# Altium project Printer.PrjPcb (part 2 of 2)

## Sheet 7.4v_BOOST.schdoc: Printer
size 431 x 279 mm; Date: 2022; Author: Renaissance; CompanyName: Upenn-ESE516; DrawnBy: Xinyang Tan;  Yuxin Wang; Engineer: Xinyang Tan;  Yuxin Wang; Address1: 200 S 33 St; Address2: Moore Building, Rm 101; Address3: Philadephla, PA 19104; DocumentNumber: 3; Revision: 1.0; SheetNumber: 3; SheetTotal: 9
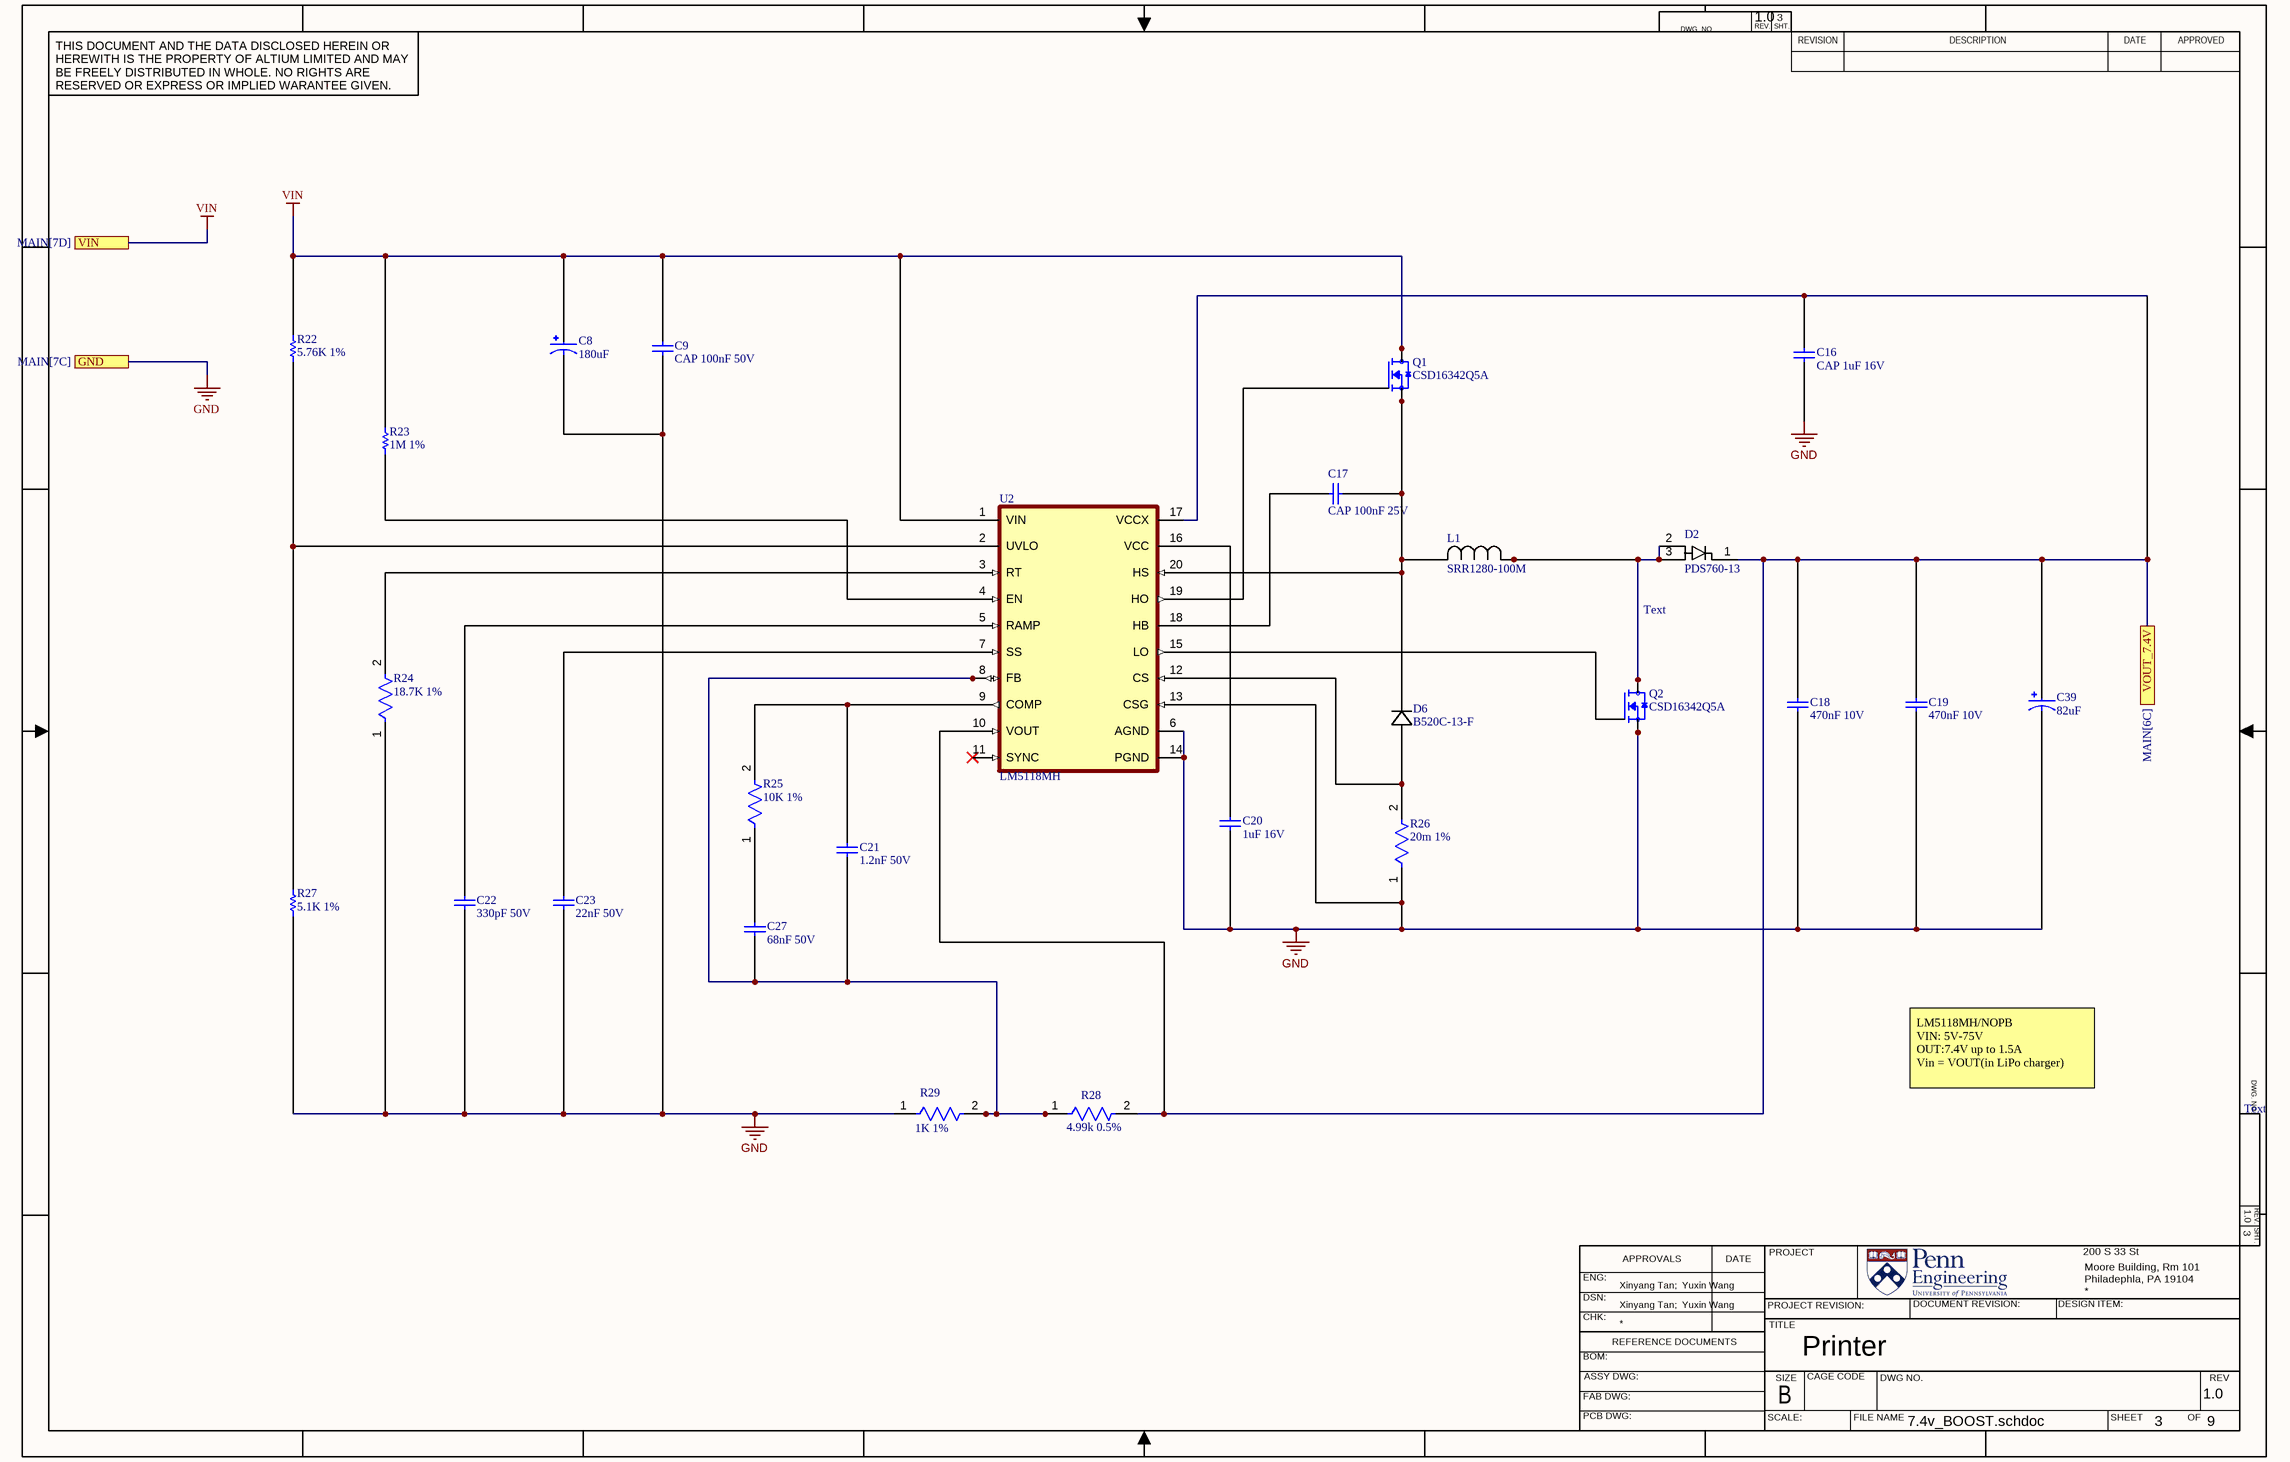
[diagram p7: 7.4v_BOOST.schdoc]

### Parts
C8  180uF  [CAP_16SVPF180M]
C9  CAP 100nF 50V  [CAPC0805(2012)100_L]
C16  CAP 1uF 16V  [CAPC0805(2012)100_N]
C17  CAP 100nF 25V  [CAPC0805(2012)75_M]
C18  470nF 10V  [CAPC0402(1005)60_M]
C19  470nF 10V  [CAPC0402(1005)60_M]
C20  1uF 16V  [CAPC0805(2012)100_N]
C21  1.2nF 50V  [CAPC0805(2012)100_L]
C22  330pF 50V  [CAPC0805(2012)145_L]
C23  22nF 50V  [CAPC0805(2012)75_N]
C27  68nF 50V  [CAPC1206(3216)100_L]
C39  82uF  [CHEMI-F80]
D2  PDS760-13  [POWERDI5_DIO]
D6  B520C-13-F  [SMC_DIO]
L1  SRR1280-100M  [IND_BOURNS_SRR1280]
Q1  CSD16342Q5A  [DQJ8_TEX]
Q2  CSD16342Q5A  [DQJ8_TEX]
R22  5.76K 1%  [RESC1608X55X25ML10T15]
R23  1M 1%  [RESC1608X55X25LL10T15]
R24  18.7K 1%  [FP-RT0805-MFG]
R25  10K 1%  [FP-RMCF0402-IPC_C]
R26  20m 1%  [FP-PRL1632-IPC_B]
R27  5.1K 1%  [RESC1608X55X25ML10T15]
R28  4.99k 0.5%  [FP-RG1608-IPC_C]
R29  1K 1%  [FP-RC0603-0_55-IPC_C]
U2  LM5118MH  [MXA20A]

### Ports
GND (see MAIN[7C]), VIN (see MAIN[7D]), VOUT_7.4V (see MAIN[6C])

### Nets
GND: C8.2 C9.1 C16.1 C18.1 C19.1 C20.1 C22.1 C23.1 C39.2 Q2.1(S) Q2.2(S) Q2.3(S) R24.1 R26.1 R27.1 R29.1 U2.6(AGND) U2.13(CSG) U2.14(PGND) ; port GND
VIN: C8.1 C9.2 Q1.5(D) Q1.6(D) Q1.7(D) Q1.8(D) R22.2 R23.2 U2.1(VIN) ; port VIN  [project net VOUT]
VOUT_7.4V: C16.2 C18.2 C19.2 C39.1 D2.1 R28.2 U2.10(VOUT) U2.17(VCCX) ; port VOUT_7.4V
NetC17_1: C17.1 U2.18(HB)
NetC17_2: C17.2 D6.1 L1.2 Q1.1(S) Q1.2(S) Q1.3(S) U2.20(HS)
NetC20_2: C20.2 U2.16(VCC)
NetC21_1: C21.1 C27.1 R28.1 R29.2 U2.8(FB)
NetC21_2: C21.2 R25.2 U2.9(COMP)
NetC22_2: C22.2 U2.5(RAMP)
NetC23_2: C23.2 U2.7(SS)
NetC27_2: C27.2 R25.1
NetD2_2: D2.2 D2.3 L1.1 Q2.5(D) Q2.6(D) Q2.7(D) Q2.8(D)
NetD6_2: D6.2 R26.2 U2.12(CS)
NetQ1_4: Q1.4(G) U2.19(HO)
NetQ2_4: Q2.4(G) U2.15(LO)
NetR22_1: R22.1 R27.2 U2.2(UVLO)
NetR23_1: R23.1 U2.4(EN)
NetR24_2: R24.2 U2.3(RT)

Not connected (* = marked no-connect by the designer): U2 11(SYNC)*

### Notes on the sheet
- Text
- LM5118MH/NOPB
  VIN: 5V-75V
  OUT:7.4V up to 1.5A
  Vin = VOUT(in LiPo charger)
- DWG. NO.
- REV.
- SHT.
- THIS DOCUMENT AND THE DATA DISCLOSED HEREIN OR HEREWITH IS THE PROPERTY OF ALTIUM LIMITED AND MAY BE FREELY DISTRIBUTED IN WHOLE. NO RIGHTS ARE RESERVED OR EXPRESS OR IMPLIED WARANTEE GIVEN.
- REVISION
- DESCRIPTION
- DATE
- APPROVED
- ENG:
- APPROVALS
- PROJECT
- DSN:
- CHK:
- REFERENCE DOCUMENTS
- PROJECT REVISION:
- TITLE
- DOCUMENT REVISION:
- DESIGN ITEM:
- BOM:
- FAB DWG:
- PCB DWG:
- ASSY DWG:
- SCALE:
- SIZE
- B
- CAGE CODE
- FILE NAME
- DWG NO.
- SHEET
- OF
- REV

### Library data of the parts
C8 = 16SVPF180M: Price: None; MP: 16SVPF180M; Availability: Unavailable; Value: *; Package: None
C9 = CMP-1036-04418-1: CAP 100nF 50V ±5% 0805 (2012 Metric) Thickness 1mm SMD; Case-EIA: 0805; Tolerance: Â±5%; Case-Metric: 2012; Max Thickness: 1 mm; Technology: SMT; Value: 100nF; Rated Voltage: 50 V
C16 C20 = CMP-1036-04745-1: CAP 1uF 16V ±5% 0805 (2012 Metric) Thickness 1mm SMD; Case-Metric: 2012; Case-EIA: 0805; Tolerance: Â±5%; Value: 1uF; Technology: SMT; Rated Voltage: 16 V; Max Thickness: 1 mm
C17 = CMP-1036-04412-1: CAP 100nF 25V ±20% 0805 (2012 Metric) Thickness 0.75mm SMD; Tolerance: Â±20%; Case-Metric: 2012; Case-EIA: 0805; Technology: SMT; Value: 100nF; Max Thickness: 0.75 mm; Rated Voltage: 25 V
C18 C19 = CMP-1034-02108-1: CAP 470nF 10V -20% to +80% 0402 (1005 Metric) Thickness 0.6mm SMD; Case-Metric: 1005; Case-EIA: 0402; Technology: SMT; Max Thickness: 0.6 mm; Rated Voltage: 10 V; Tolerance: -20% to +80%; Value: 470nF
C21 = CMP-1036-03053-1: CAP 1.2nF 50V ±10% 0805 (2012 Metric) Thickness 1mm SMD; Case-EIA: 0805; Case-Metric: 2012; Tolerance: Â±10%; Value: 1.2nF; Rated Voltage: 50 V; Max Thickness: 1 mm; Technology: SMT
C22 = CMP-1036-02501-1: CAP 330pF 50V ±5% 0805 (2012 Metric) Thickness 1.45mm SMD; Tolerance: Â±5%; Case-Metric: 2012; Case-EIA: 0805; Value: 330pF; Max Thickness: 1.45 mm; Technology: SMT; Rated Voltage: 50 V
C23 = CMP-1036-04068-1: CAP 22nF 50V ±20% 0805 (2012 Metric) Thickness 0.75mm SMD; Case-Metric: 2012; Case-EIA: 0805; Tolerance: Â±20%; Technology: SMT; Value: 22nF; Rated Voltage: 50 V; Max Thickness: 0.75 mm
C27 = CMP-1037-04097-1: CAP 68nF 50V -20% to +80% 1206 (3216 Metric) Thickness 1mm SMD; Case-Metric: 3216; Case-EIA: 1206; Technology: SMT; Tolerance: -20% to +80%; Max Thickness: 1 mm; Value: 68nF; Rated Voltage: 50 V
C39 = APXE160ARA820MF80G: No Description Available; Mfr_Name: Nippon Chemi-Con; Type: DEV; Copyright: Copyright (C) 2022 Ultra Librarian. All rights reserved.; Manufacturer_Part_Number: APXE160ARA820MF80G; Digi-Key_Part_Number_1: 565-3209-1-ND; Digi-Key_Part_Number_2: 565-3209-2-ND; Digi-Key_Part_Number_3: 565-3209-6-ND; RefDes: RefDes
D2 = PDS760-13: No Description Available; Mfr_Name: Diodes Inc; Type: DEV; Copyright: Copyright (C) 2022 Ultra Librarian. All rights reserved.; Manufacturer_Part_Number: PDS760-13; Digi-Key_Part_Number_1: PDS760DITR-ND; Digi-Key_Part_Number_2: PDS760DICT-ND; Digi-Key_Part_Number_3: PDS760DIDKR-ND; RefDes: RefDes
D6 = B520C-13-F: No Description Available; Mfr_Name: Diodes Inc; Type: DEV; Copyright: Copyright (C) 2022 Ultra Librarian. All rights reserved.; Manufacturer_Part_Number: B520C-13-F; Digi-Key_Part_Number_1: B520C-FDICT-ND; Digi-Key_Part_Number_2: B520C-FDIDKR-ND; Digi-Key_Part_Number_3: B520C-FDITR-ND; RefDes: RefDes
L1 = SRR1280-100M: No Description Available; Mfr_Name: Bourns Electronics; Type: DEV; Copyright: Copyright (C) 2022 Ultra Librarian. All rights reserved.; Manufacturer_Part_Number: SRR1280-100M; Digi-Key_Part_Number_1: SRR1280-100MCT-ND; Digi-Key_Part_Number_2: SRR1280-100MDKR-ND; Digi-Key_Part_Number_3: SRR1280-100MTR-ND; RefDes: RefDes
Q1 Q2 = CSD16342Q5A: No Description Available; Mfr_Name: Texas Instruments; Type: DEV; Copyright: Copyright (C) 2022 Ultra Librarian. All rights reserved.; Manufacturer_Part_Number: CSD16342Q5A; Digi-Key_Part_Number_1: 296-30314-1-ND; Digi-Key_Part_Number_2: 296-30314-2-ND; Digi-Key_Part_Number_3: 296-30314-6-ND; Digi-Key_Part_Number_4: 2156-CSD16342Q5A-ND; RefDes: RefDes
R22 = CMP-2000-04094-1: Part Number: RC0603FR-075K76L; Manufacturer: Yageo
R23 = CMP-1659-00056-1: Chip Resistor, 1 MOhm, +/- 1%, 100 mW, -55 to 155 degC, 0603 (1608 Metric), RoHS, Tape and Reel; Voltage Rating (DC): 25 V; Tolerance: 20%; Case\Package: Radial; Capacitance: 1 mF; Min Operating Temperature: -40 degC; PackageDescription: 2-Pin Surface Mount Device, Body 1.6 x 0.8 mm; ComponentLink1Description: Manufacturer URL; Radiation Hardening: No; DatasheetVersion: Rev. 4, 02/2016; REACH SVHC: No SVHC; Length: 20 mm; Max Operating Temperature: 85 degC; Diameter: 10 mm; Packaging: Bulk; Package Quantity: 200; PackageReference: 0603; Mount: Through Hole; ComponentLink1URL: http://www.yageo.com/; ComponentLink2URL: http://www.yageo.com/documents/recent/PYu-RC_Group_51_RoHS_L_04.pdf; ComponentLink2Description: Datasheet; Width: 0 inch; Lead Pitch: 5 mm; RoHSCompliant: true; Voltage Rating: 25 V; Height: 20 mm
R24 = CMP-2001-01702-2: RES SMD 18.7K OHM 1% 1/8W 0805; Manufacturer Part Number: RT0805FRE0718K7L; Manufacturer: Yageo; Temperature Coefficient: 50 ppm/°C; Tolerance: 0.0001; Value: 18.7KΩ; Voltage Rating: 150V; Power Rating: 0.125W; Automotive: No; Octopart: https://octopart.com/rt0805fre0718k7l-yageo-1462871; Device Class L3: Chip SMD Resistors; Temperature: -55°C to +155°C; Mouser Description: Thin Film Resistors - SMD 1/8W 18.7K ohm 1% 50ppm; Ipc Land Pattern Name: RESC200125X50; Package: RT0805; Composition: Thin Film; Temperature Range High: +155°C; Device Class L1: Passive Components; RoHS: TRUE; Series: RT; Digikey Description: RES SMD 18.7K OHM 1% 1/8W 0805; Temperature Range Low: -55°C; Height: 0.6mm; Category: Res; Footprint Url: http://www.yageo.com/exep/pages/download/literatures/PYu-R_Mount_10.pdf; Lead Free: Yes; ComponentLink2Description: Datasheet; ComponentLink2URL: http://www.yageo.com/documents/recent/PYu-RT_1-to-0.01_RoHS_L_9.pdf; Resistance: 18.7KΩ; Device Class L2: Resistors
R25 = CMP-26527-000128-1: 10kΩ ±1% 0.063W 0402 Thick Film Chip Resistor AEC-Q200 compliant; Temperature Coefficient: 100ppm/°C; Power Rating: 62.5mW; Resistance: 10kR; Max Power Dissipation: 63mW; Width: 0.02inch; Case/Package: 0402; Depth: 0.5mm; Resistor Type: Thick Film; Series: RMCF; Length: 1mm; Contact Plating: Tin; Tolerance: 1%; Number of Terminations: 2; Height: 0.016inch; Military Standard: Not; Case Code (Imperial): 0402; Size Code: 0402; Construction: Rectangular; Radiation Hardening: No; RoHS Compliant: Yes; Case Code (Metric): 1005; Packaging: Tape and Reel; Lead Free: Lead Free; Min Operating Temperature: -55°C; Max Operating Temperature: 155°C; Mount: Surface Mount; Features: Automotive AEC-Q200
R26 = CMP-2003-04773-2: 20 mOhms ±1% 1W Chip Resistor Wide 0612 (1632 Metric), Current Sense Thin Film; Resistance: 20mR; Temperature Coefficient: 100ppm/°C; Technology: THIN FILM; Termination: SMD/SMT; Series: PRL; Power Rating: 1W; Size Code: 1206; Resistor Type: Thin Film; Tolerance: 1%; Length: 0.063inch; Case Code (Metric): 3216; Number of Terminations: 2; Case/Package: 1206; Packaging: Tape and Reel; Width: 0.126inch; RoHS Compliant: Yes; Case Code (Imperial): 1206; Height: 0.024inch; Min Operating Temperature: -55°C; Package Quantity: 1; Max Operating Temperature: 125°C; Lead Free: Lead Free; Max Power Dissipation: 1W
R27 = CMP-2000-04091-1: Manufacturer: Yageo; Part Number: RC0603FR-075K1L
R28 = CMP-28537-011444-1: Automotive Metal Thin Film Chip Resistor, 0603, 4.99kΩ, 0.5%, 25ppm/°C, 0.1W, 100V; Resistance: 4.99kR; Voltage Rating (DC): 75V; Power Rating: 100mW; Packaging: Tape and Reel; Weight: 7.1E-05oz; Length: 0.063inch; Max Operating Temperature: 155°C; Case/Package: 0603; Series: RG; RoHS Compliant: Yes; Min Operating Temperature: -55°C; Case Code (Imperial): 0603; Temperature Coefficient: 25ppm/°C; Resistor Type: Thin Film; Case Code (Metric): 1608; Package Quantity: 5000; Termination: SMD/SMT; Features: Automotive AEC-Q200; Lead Free: Lead Free; Height: 0.02inch; Tolerance: 0.5%; Width: 0.8mm; Number of Terminations: 2; Max Power Dissipation: 100mW; Voltage Rating: 100V
R29 = CMP-1659-00009-5: RES 1K OHM 1% 1/10W 0603; Voltage Rating: 50V; Resistance: 1kR; Power Rating: 100mW; Temperature Coefficient: 100ppm/°C; Max Operating Temperature: 155°C; Packaging: Tape and Reel; REACH SVHC: No SVHC; Length: 1.6mm; Height: 0.45mm; Min Operating Temperature: -55°C; Military Standard: Not; Size Code: 0603; Features: Moisture Resistant; Number of Terminations: 2; Technology: THICK FILM; Series: RC; Case Code (Metric): 1608; Resistance Tolerance: 1%; Resistor Type: Thick Film; Termination: SMD/SMT; Contact Plating: Tin; Radiation Hardening: No; Max Power Dissipation: 100mW; RoHS Compliant: Yes; Lead Free: Lead Free; Case/Package: 0603; Tolerance: 1%; Case Code (Imperial): 0603; Construction: Rectangular; Depth: 0.8mm
U2 = LM5118MH: Buck, Buck-Boost Regulator Positive Output Step-Down, Step-Up/Step-Down DC-DC Controller IC 20-HTSSOP; MF: Texas Instruments; SnapEDA_Link: https://www.snapeda.com/parts/LM5118MH/Texas%20Instruments/view-part/561238/?ref=snap; Price: None; Availability: Unavailable; Package: HTSSOP-20 Texas Instruments; MP: LM5118MH; Value: *

## Sheet 3.3_buck.schdoc: Printer
size 431 x 279 mm; Date: 2022; Author: Renaissance; CompanyName: Upenn-ESE516; DrawnBy: Xinyang Tan;  Yuxin Wang; Engineer: Xinyang Tan;  Yuxin Wang; Address1: 200 S 33 St; Address2: Moore Building, Rm 101; Address3: Philadephla, PA 19104; DocumentNumber: 6; Revision: 1.0; SheetNumber: 6; SheetTotal: 9
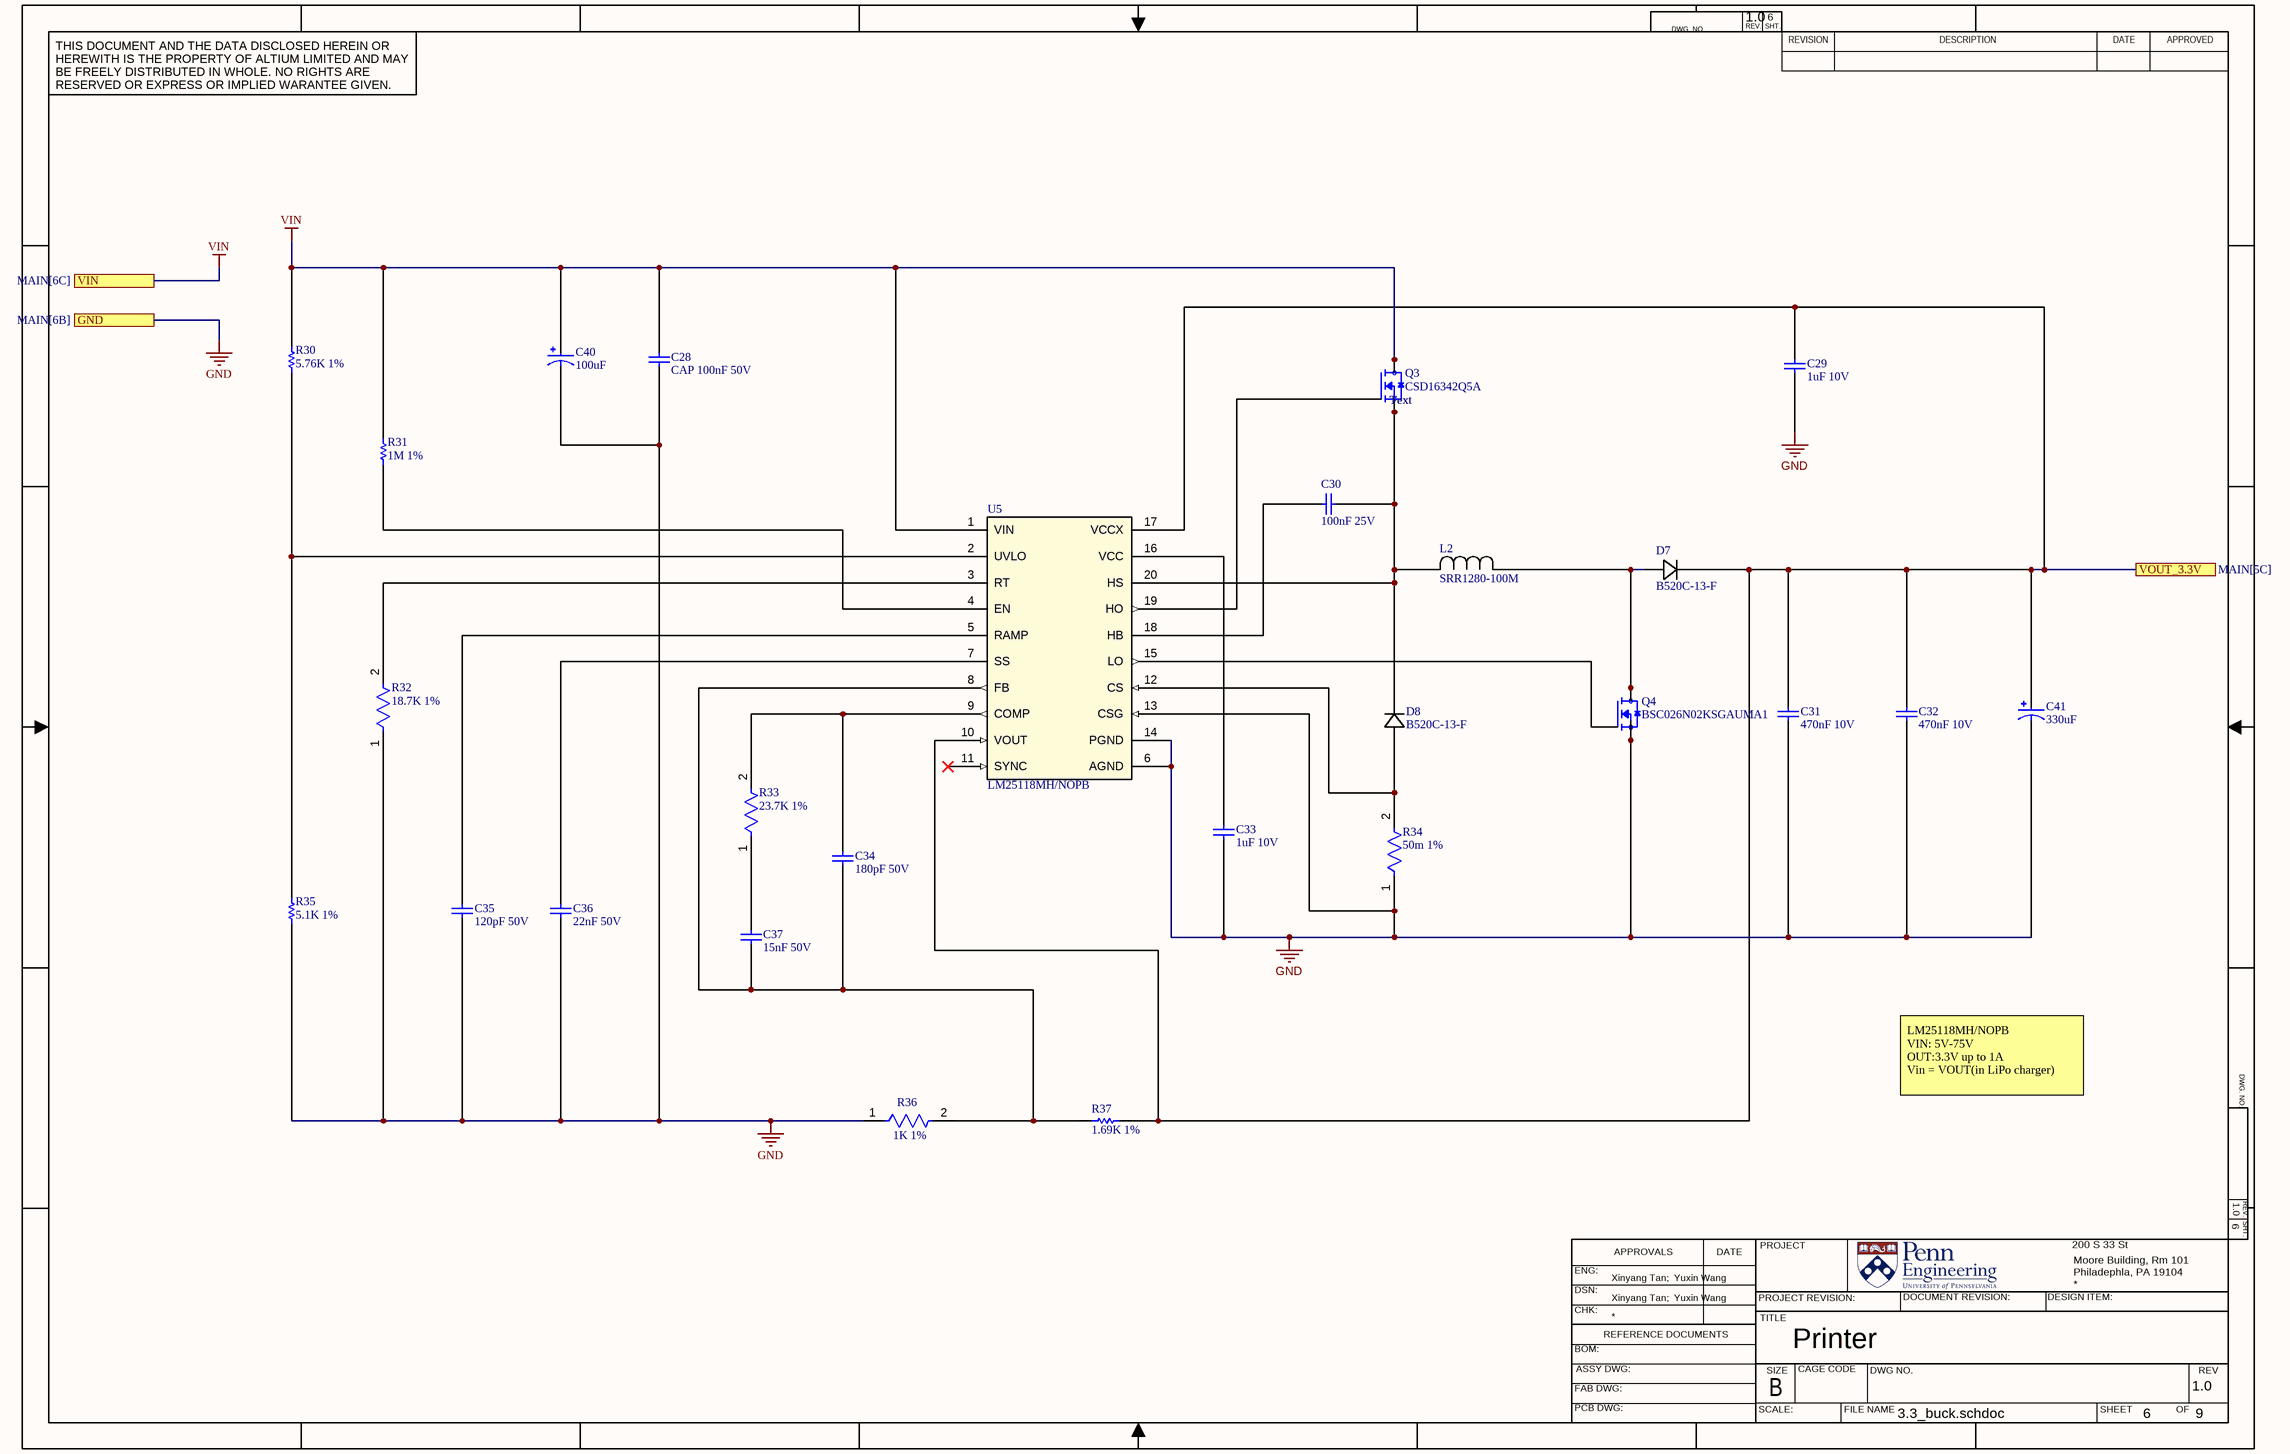
[diagram p8: 3.3_buck.schdoc]

### Parts
C28  CAP 100nF 50V  [CAPC0805(2012)100_L]
C29  1uF 10V  [CAPC1608X90X35ML15T15]
C30  100nF 25V  [CAPC0805(2012)75_M]
C31  470nF 10V  [CAPC0402(1005)60_M]
C32  470nF 10V  [CAPC0402(1005)60_M]
C33  1uF 10V  [CAPC1608X90X35ML15T15]
C34  180pF 50V  [CAPC0805(2012)100_L]
C35  120pF 50V  [CAPC0805(2012)75_L]
C36  22nF 50V  [CAPC0805(2012)75_N]
C37  15nF 50V  [CAPC0805(2012)75_N]
C40  100uF  [CAP_593D-D_VSS]
C41  330uF  [CHEMI-F80]
D7  B520C-13-F  [SMC_DIO]
D8  B520C-13-F  [SMC_DIO]
L2  SRR1280-100M  [IND_BOURNS_SRR1280]
Q3  CSD16342Q5A  [DQJ8_TEX]
Q4  BSC026N02KSGAUMA1  [PG-TDSON-8_BSC026N02KSGAUMA1_INF]
R30  5.76K 1%  [RESC1608X55X25ML10T15]
R31  1M 1%  [RESC1608X55X25LL10T15]
R32  18.7K 1%  [FP-RT0805-MFG]
R33  23.7K 1%  [FP-AC0402-MFG]
R34  50m 1%  [FP-CSR1206-IPC_A]
R35  5.1K 1%  [RESC1608X55X25ML10T15]
R36  1K 1%  [FP-RC0603-0_55-IPC_C]
R37  1.69K 1%  [RESC1608X55X25NL10T15]
U5  LM25118MH/NOPB  [MXA20A]

### Ports
GND (see MAIN[6B]), VIN (see MAIN[6C]), VOUT_3.3V (see MAIN[5C])

### Nets
GND: C28.1 C29.1 C31.1 C32.1 C33.1 C35.1 C36.1 C40.2 C41.2 Q4.2(S) Q4.3(S) R32.1 R34.1 R35.1 R36.1 U5.6(AGND) U5.13(CSG) U5.14(PGND) ; port GND
VIN: C28.2 C40.1 Q3.5(D) Q3.6(D) Q3.7(D) Q3.8(D) R30.2 R31.2 U5.1(VIN) ; port VIN  [project net VOUT]
VOUT_3.3V: C29.2 C31.2 C32.2 C41.1 D7.1 R37.2 U5.10(VOUT) U5.17(VCCX) ; port VOUT_3.3V
NetC30_1: C30.1 U5.18(HB)
NetC30_2: C30.2 D8.1 L2.2 Q3.1(S) Q3.2(S) Q3.3(S) U5.20(HS)
NetC33_2: C33.2 U5.16(VCC)
NetC34_1: C34.1 C37.1 R36.2 R37.1 U5.8(FB)
NetC34_2: C34.2 R33.2 U5.9(COMP)
NetC35_2: C35.2 U5.5(RAMP)
NetC36_2: C36.2 U5.7(SS)
NetC37_2: C37.2 R33.1
NetD7_2: D7.2 L2.1 Q4.5(D) Q4.6(D) Q4.7(D) Q4.8(D)
NetD8_2: D8.2 R34.2 U5.12(CS)
NetQ3_4: Q3.4(G) U5.19(HO)
NetQ4_4: Q4.4(G) U5.15(LO)
NetR30_1: R30.1 R35.2 U5.2(UVLO)
NetR31_1: R31.1 U5.4(EN)
NetR32_2: R32.2 U5.3(RT)

Not connected (* = marked no-connect by the designer): Q4 1(S); U5 11(SYNC)*

### Notes on the sheet
- (near Q3) Text
- LM25118MH/NOPB
  VIN: 5V-75V
  OUT:3.3V up to 1A
  Vin = VOUT(in LiPo charger)
- DWG. NO.
- REV.
- SHT.
- THIS DOCUMENT AND THE DATA DISCLOSED HEREIN OR HEREWITH IS THE PROPERTY OF ALTIUM LIMITED AND MAY BE FREELY DISTRIBUTED IN WHOLE. NO RIGHTS ARE RESERVED OR EXPRESS OR IMPLIED WARANTEE GIVEN.
- REVISION
- DESCRIPTION
- DATE
- APPROVED
- ENG:
- APPROVALS
- PROJECT
- DSN:
- CHK:
- REFERENCE DOCUMENTS
- PROJECT REVISION:
- TITLE
- DOCUMENT REVISION:
- DESIGN ITEM:
- BOM:
- FAB DWG:
- PCB DWG:
- ASSY DWG:
- SCALE:
- SIZE
- B
- CAGE CODE
- FILE NAME
- DWG NO.
- SHEET
- OF
- REV

### Library data of the parts
C28 = CMP-1036-04418-1: as C9 on sheet 7.4v_BOOST; Max Thickness: 1 mm; Technology: SMT; Value: 100nF; Rated Voltage: 50 V
C29 C33 = CMP-1035-02733-2: Manufacturer: Kemet; Part Number: C0603C105K8RACTU
C30 = CMP-1036-04412-1: as C17 on sheet 7.4v_BOOST; Technology: SMT; Value: 100nF; Max Thickness: 0.75 mm; Rated Voltage: 25 V
C31 C32 = CMP-1034-02108-1: as C18 on sheet 7.4v_BOOST; Technology: SMT; Max Thickness: 0.6 mm; Rated Voltage: 10 V; Tolerance: -20% to +80%; Value: 470nF
C34 = CMP-1036-02228-1: CAP 180pF 50V ±20% 0805 (2012 Metric) Thickness 1mm SMD; Tolerance: Â±20%; Case-Metric: 2012; Case-EIA: 0805; Rated Voltage: 50 V; Max Thickness: 1 mm; Value: 180pF; Technology: SMT
C35 = CMP-1036-02051-1: CAP 120pF 50V ±10% 0805 (2012 Metric) Thickness 0.75mm SMD; Case-Metric: 2012; Tolerance: Â±10%; Case-EIA: 0805; Technology: SMT; Value: 120pF; Rated Voltage: 50 V; Max Thickness: 0.75 mm
C36 = CMP-1036-04068-1: as C23 on sheet 7.4v_BOOST; Technology: SMT; Value: 22nF; Rated Voltage: 50 V; Max Thickness: 0.75 mm
C37 = CMP-1036-03960-1: CAP 15nF 50V ±20% 0805 (2012 Metric) Thickness 0.75mm SMD; Case-Metric: 2012; Tolerance: Â±20%; Case-EIA: 0805; Technology: SMT; Rated Voltage: 50 V; Max Thickness: 0.75 mm; Value: 15nF
C40 = 593D107X0010D2TE3: No Description Available; Mfr_Name: Vishay; Type: DEV; Copyright: Copyright (C) 2022 Ultra Librarian. All rights reserved.; Manufacturer_Part_Number: 593D107X0010D2TE3; Digi-Key_Part_Number_1: 718-1100-2-ND; Digi-Key_Part_Number_2: 718-1100-1-ND; Digi-Key_Part_Number_3: 718-1100-6-ND; RefDes: RefDes
C41 = APXE6R3ARA331MF80G: No Description Available; Mfr_Name: Nippon Chemi-Con; Type: DEV; Copyright: Copyright (C) 2022 Ultra Librarian. All rights reserved.; Manufacturer_Part_Number: APXE6R3ARA331MF80G; Digi-Key_Part_Number_1: 565-3190-1-ND; Digi-Key_Part_Number_2: 565-3190-2-ND; Digi-Key_Part_Number_3: 565-3190-2-NDL; Digi-Key_Part_Number_4: 565-3190-6-ND; RefDes: RefDes
D7 D8 = B520C-13-F: as D6 on sheet 7.4v_BOOST; Copyright: Copyright (C) 2022 Ultra Librarian. All rights reserved.; Manufacturer_Part_Number: B520C-13-F; Digi-Key_Part_Number_1: B520C-FDICT-ND; Digi-Key_Part_Number_2: B520C-FDIDKR-ND; Digi-Key_Part_Number_3: B520C-FDITR-ND; RefDes: RefDes
L2 = SRR1280-100M: as L1 on sheet 7.4v_BOOST; Copyright: Copyright (C) 2022 Ultra Librarian. All rights reserved.; Manufacturer_Part_Number: SRR1280-100M; Digi-Key_Part_Number_1: SRR1280-100MCT-ND; Digi-Key_Part_Number_2: SRR1280-100MDKR-ND; Digi-Key_Part_Number_3: SRR1280-100MTR-ND; RefDes: RefDes
Q3 = CSD16342Q5A: as Q1 on sheet 7.4v_BOOST; Copyright: Copyright (C) 2022 Ultra Librarian. All rights reserved.; Manufacturer_Part_Number: CSD16342Q5A; Digi-Key_Part_Number_1: 296-30314-1-ND; Digi-Key_Part_Number_2: 296-30314-2-ND; Digi-Key_Part_Number_3: 296-30314-6-ND; Digi-Key_Part_Number_4: 2156-CSD16342Q5A-ND; RefDes: RefDes
Q4 = BSC026N02KSGAUMA1: No Description Available; Mfr_Name: Infineon; Type: DEV; Copyright: Copyright (C) 2022 Ultra Librarian. All rights reserved.; Manufacturer_Part_Number: BSC026N02KSGAUMA1; Digi-Key_Part_Number_1: BSC026N02KSGAUMA1TR-ND; Digi-Key_Part_Number_2: BSC026N02KSGAUMA1CT-ND; Digi-Key_Part_Number_3: BSC026N02KSGAUMA1DKR-ND; RefDes: RefDes
R30 = CMP-2000-04094-1: as R22 on sheet 7.4v_BOOST
R31 = CMP-1659-00056-1: as R23 on sheet 7.4v_BOOST; Min Operating Temperature: -40 degC; PackageDescription: 2-Pin Surface Mount Device, Body 1.6 x 0.8 mm; ComponentLink1Description: Manufacturer URL; Radiation Hardening: No; DatasheetVersion: Rev. 4, 02/2016; REACH SVHC: No SVHC; Length: 20 mm; Max Operating Temperature: 85 degC; Diameter: 10 mm; Packaging: Bulk; Package Quantity: 200; PackageReference: 0603; Mount: Through Hole; ComponentLink1URL: http://www.yageo.com/; ComponentLink2URL: http://www.yageo.com/documents/recent/PYu-RC_Group_51_RoHS_L_04.pdf; ComponentLink2Description: Datasheet; Width: 0 inch; Lead Pitch: 5 mm; RoHSCompliant: true; Voltage Rating: 25 V; Height: 20 mm
R32 = CMP-2001-01702-2: as R24 on sheet 7.4v_BOOST; Automotive: No; Octopart: https://octopart.com/rt0805fre0718k7l-yageo-1462871; Device Class L3: Chip SMD Resistors; Temperature: -55°C to +155°C; Mouser Description: Thin Film Resistors - SMD 1/8W 18.7K ohm 1% 50ppm; Ipc Land Pattern Name: RESC200125X50; Package: RT0805; Composition: Thin Film; Temperature Range High: +155°C; Device Class L1: Passive Components; RoHS: TRUE; Series: RT; Digikey Description: RES SMD 18.7K OHM 1% 1/8W 0805; Temperature Range Low: -55°C; Height: 0.6mm; Category: Res; Footprint Url: http://www.yageo.com/exep/pages/download/literatures/PYu-R_Mount_10.pdf; Lead Free: Yes; ComponentLink2Description: Datasheet; ComponentLink2URL: http://www.yageo.com/documents/recent/PYu-RT_1-to-0.01_RoHS_L_9.pdf; Resistance: 18.7KΩ; Device Class L2: Resistors
R33 = CMP-03412-035105-1: RES SMD 23.7K OHM 1% 1/16W 0402; Manufacturer Part Number: AC0402FR-0723K7L; Manufacturer: Yageo; Power Rating: 0.0625W; Value: 23.7KΩ; Voltage Rating: 50V; Tolerance: 0.01; Automotive Grade: Grade 0; Device Class L3: Chip SMD Resistors; Device Class L2: Resistors; Octopart: https://octopart.com/ac0402fr-0723k7l-yageo-71366670; Composition: Thick Film; Mouser Description: Thick Film Resistors - SMD 1/16W 23.7K ohm 1% AEC-Q200; Lead Free: Yes; Height: 0.37mm; Temperature: -55°C to +155°C; Temperature Range High: +155°C; Device Class L1: Passive Components; Package: AC0402; Digikey Description: RES SMD 23.7K OHM 1% 1/16W 0402; Temperature Range Low: -55°C; Footprint Url: http://www.yageo.com/exep/pages/download/literatures/PYu-R_Mount_10.pdf; ComponentLink2Description: Datasheet; Automotive: Yes; ComponentLink2URL: http://www.yageo.com/documents/recent/PYu-AC_51_RoHS_L_6.pdf; Category: Res; Ipc Land Pattern Name: RESC10050X32; RoHS: TRUE; Resistance: 23.7KΩ; Series: AC
R34 = CMP-26527-003641-1: General Purpose Thick Film Chip Resistor, 1206, 50mΩ, 1%, 100ppm/°C, 0.5W; Max Power Dissipation: 500mW; Resistance: 50mR; Depth: 1.55mm; Length: 0.12inch; Case/Package: 1206; Case Code (Metric): 3216; Case Code (Imperial): 1206; Number of Terminations: 2; Lead Free: Lead Free; Packaging: Tape and Reel; Mount: Surface Mount; Construction: Rectangular; Height: 0.026inch; Contact Plating: Tin; Resistor Type: Thick Film; Min Operating Temperature: -55°C; Size Code: 1206; Series: CSR; Max Operating Temperature: 155°C; Temperature Coefficient: 100ppm/°C; Tolerance: 1%; Radiation Hardening: No; Width: 0.061inch; Military Standard: Not; RoHS Compliant: Yes; Power Rating: 500mW
R35 = CMP-2000-04091-1: as R27 on sheet 7.4v_BOOST
R36 = CMP-1659-00009-5: as R29 on sheet 7.4v_BOOST; Max Operating Temperature: 155°C; Packaging: Tape and Reel; REACH SVHC: No SVHC; Length: 1.6mm; Height: 0.45mm; Min Operating Temperature: -55°C; Military Standard: Not; Size Code: 0603; Features: Moisture Resistant; Number of Terminations: 2; Technology: THICK FILM; Series: RC; Case Code (Metric): 1608; Resistance Tolerance: 1%; Resistor Type: Thick Film; Termination: SMD/SMT; Contact Plating: Tin; Radiation Hardening: No; Max Power Dissipation: 100mW; RoHS Compliant: Yes; Lead Free: Lead Free; Case/Package: 0603; Tolerance: 1%; Case Code (Imperial): 0603; Construction: Rectangular; Depth: 0.8mm
R37 = CMP-2000-03936-1: Manufacturer: Yageo; Part Number: RC0603FR-071K69L
U5 = LM25118MH/NOPB: No Description Available; Mfr_Name: Texas Instruments; Copyright: Copyright (C) 2022 Ultra Librarian. All rights reserved.; Manufacturer_Part_Number: LM25118MH/NOPB; Digi-Key_Part_Number_1: 296-38995-ND; Digi-Key_Part_Number_2: LM25118MH/NOPB-ND; Digi-Key_Part_Number_3: 2156-LM25118MH/NOPB-ND; RefDes: RefDes; Type: DEV

## Nets that join several sheets
3v3: MAIN (R7.1 R16.2 TP27.1), MCU (7 pins), Memory (5 pins), Temperature_Sensor (5 pins), Connector_circuit (J2.1 J3.2)
7v4: MAIN (R6.2 TP23.1), Connector_circuit (P2.5)
GND: MAIN (10 pins), FTDI (10 pins), MCU (19 pins), Memory (5 pins), Temperature_Sensor (C38.2 P3.1 U7.4 U7.5), Connector_circuit (J2.4 J3.1 P2.1 P2.2), LiPo_Charger (11 pins), 7.4v_BOOST (19 pins), 3.3_buck (18 pins)
VBAT: MAIN (P1.3), LiPo_Charger (C26.1 U6.2 U6.3)
VBUS: MAIN (J1.1), FTDI (C2.2 D1.4 FB1.1)
VOUT: MAIN (R15.2 TP24.1), 7.4v_BOOST (9 pins), 3.3_buck (9 pins)
Vout_BQ: MAIN (R15.1), LiPo_Charger (6 pins)
VUSB: MAIN (TP1.1), FTDI (6 pins), LiPo_Charger (C24.2 U6.13)
ADC_GPIO_Touchscreen_X-: MAIN (TP35.1), MCU (U4.31), Connector_circuit (J3.14)
ADC_GPIO_Touchscreen_Y+: MAIN (TP26.1), MCU (U4.33), Connector_circuit (R40.1)
BQ_BAT_TS: MAIN (R17.2 TP5.1), LiPo_Charger (U6.1)
FLASH_MEM_SPI_SS: MCU (U4.37), Memory (R13.1 SD1.2 TP11.1)
GPIO_Touchscreen_CS: MAIN (TP37.1), MCU (U4.22), Connector_circuit (J3.7)
GPIO_Touchscreen_D/C: MAIN (TP22.1), MCU (U4.41), Connector_circuit (J3.8)
GPIO_Touchscreen_X+: MAIN (TP29.1), MCU (U4.18), Connector_circuit (R41.1)
GPIO_Touchscreen_Y-: MAIN (TP31.1), MCU (U4.19), Connector_circuit (J3.13)
GPIO_Ultrasonic_Echo: MAIN (TP25.1), MCU (U4.28), Connector_circuit (J2.3)
GPIO_Ultrasonic_Trig: MAIN (TP21.1), MCU (U4.27), Connector_circuit (J2.2)
MCU_LED: MAIN (DS1.1), MCU (U4.16)
MCU_RX_UART_CLI: MAIN (TP4.1), FTDI (U1.7), MCU (U4.44)
MCU_TX_UART_CLI: MAIN (TP2.1), FTDI (U1.10), MCU (U4.43)
MEM_SPI_CLK: MAIN (R10.2), Memory (SD1.5 TP10.1)
MEM_SPI_MISO: MAIN (R9.2), Memory (SD1.7 TP9.1)
MEM_SPI_MOSI: MAIN (R8.2), Memory (SD1.3 TP8.1)
SERCOM0_SPI_CLK: MAIN (TP34.1), MCU (U4.39), Connector_circuit (J3.4)
SERCOM0_SPI_MISO: MAIN (TP32.1), MCU (U4.40), Connector_circuit (J3.5)
SERCOM0_SPI_MOSI: MAIN (TP36.1), MCU (U4.38), Connector_circuit (J3.6)
SERCOM1_PAD2_SPI_MISO: MAIN (R9.1), MCU (U4.8)
SERCOM1_PAD2_SPI_MOSI: MAIN (R8.1), MCU (U4.11)
SERCOM1_PAD3_SPI_SCK: MAIN (R10.1), MCU (U4.12)
SERCOM3_I2C_SDA: MAIN (TP17.1), MCU (U4.15), Temperature_Sensor (P3.3 R39.1 U7.3)
SERCOM5_Printer_RX: MAIN (TP28.1), MCU (U4.14), Connector_circuit (P2.4)
SERCOM5_Printer_TX: MAIN (TP30.1), MCU (U4.13), Connector_circuit (P2.3)
SERCOME3_I2C_SCL: MAIN (TP18.1), MCU (U4.9), Temperature_Sensor (P3.4 R38.1 U7.2)
USB_DATA_N: MAIN (J1.2), FTDI (C5.2 D1.3 R1.1)
USB_DATA_P: MAIN (J1.3), FTDI (C6.2 D1.2 R2.1)
VOUT_3.3V: MAIN (R16.1), 3.3_buck (8 pins)
VOUT_7.4V: MAIN (R6.1), 7.4v_BOOST (8 pins)

## Assembly variants
Build_Alt: not fitted R40 R41 TP1 TP2 TP3 TP4 TP5 TP6 TP7 TP8 TP9 TP10 TP11 TP12 TP13 TP14 TP15 TP16 TP17 TP18 TP21 TP22 TP23 TP24 TP25 TP26 TP27 TP28 TP29 TP30 TP31 TP32 TP34 TP35 TP36 TP37